# EAGLE design irisc (EAGLE 9.2.2)
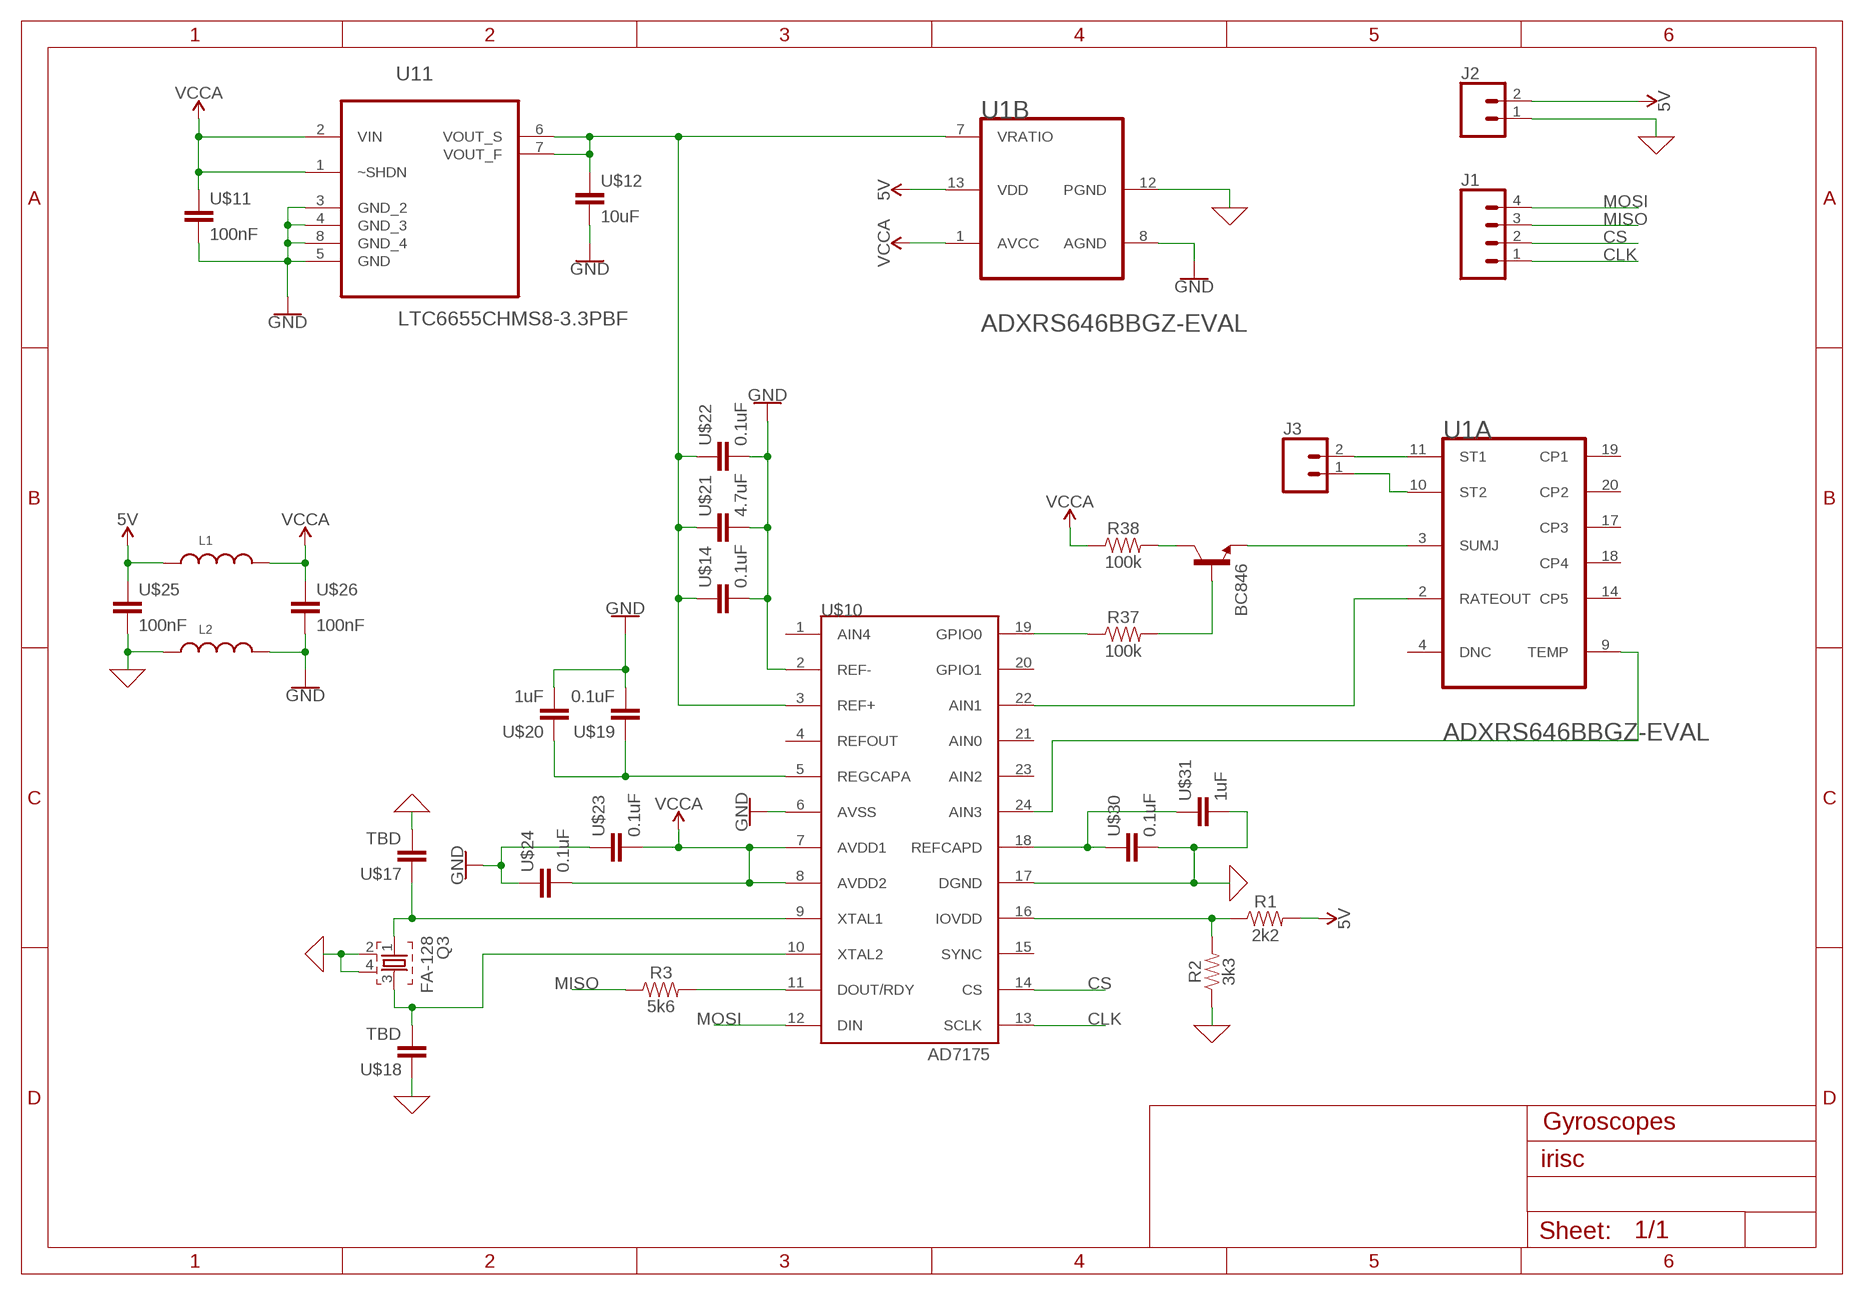
[diagram p0: schematic, sheet 1]

## Parts
J1  CONN_04  [1X04]
J2  CONN_02  [1X02]
J3  CONN_02  [1X02]
L1  WE-CBA_0805_782853152_HC  [WE-CBA_0805(W=4)]
L2  WE-CBA_0805_782853152_HC  [WE-CBA_0805(W=4)]
Q3  FA-128  [FA-128]
R1  2k2  100KOHM-HORIZ_KIT-1/4W-1%  [AXIAL-0.3-KIT]
R2  3k3  100KOHM-HORIZ_KIT-1/4W-1%  [AXIAL-0.3-KIT]
R3  5k6  100KOHM-HORIZ_KIT-1/4W-1%  [AXIAL-0.3-KIT]
R37  100k  100KOHM-HORIZ_KIT-1/4W-1%  [AXIAL-0.3-KIT]
R38  100k  100KOHM-HORIZ_KIT-1/4W-1%  [AXIAL-0.3-KIT]
T1  BC846  [SOT23]
U1  ANALOG_DEVICES_ADXRS646BBGZEVAL  [HDRVR20W64P762X254_2X10_2540X1016X254B]
U11  LTC6655CHMS8-3.3PBF  [SOP65P490X110-8N]
U$10  AD7175  [TSSOP24]
U$11  100nF  CAPACITOR_0603_N  [RESC0603_N]
U$12  10uF  CAPACITOR_0805_L  [RESC0805_L]
U$14  0.1uF  CAPACITOR_0603_N  [RESC0603_N]
U$17  TBD  CAPACITOR_0805_L  [RESC0805_L]
U$18  TBD  CAPACITOR_0805_L  [RESC0805_L]
U$19  0.1uF  CAPACITOR_0603_N  [RESC0603_N]
U$20  1uF  CAPACITOR_0603_N  [RESC0603_N]
U$21  4.7uF  CAPACITOR_0603_N  [RESC0603_N]
U$22  0.1uF  CAPACITOR_0603_N  [RESC0603_N]
U$23  0.1uF  CAPACITOR_0603_N  [RESC0603_N]
U$24  0.1uF  CAPACITOR_0603_N  [RESC0603_N]
U$25  100nF  CAPACITOR_0603_N  [RESC0603_N]
U$26  100nF  CAPACITOR_0603_N  [RESC0603_N]
U$30  0.1uF  CAPACITOR_0603_N  [RESC0603_N]
U$31  1uF  CAPACITOR_0603_N  [RESC0603_N]

## Nets
0: J2.1 L2.1 Q3.2 Q3.4 R2.P$1 U1.12(B:PGND) U$10.17(DGND) U$17.2 U$18.1 U$25.2 U$30.2 U$31.2 ; supply symbol labelled GND
5V: J2.2 L1.1 R1.P$2 U1.13(B:VDD) U$25.1
CLK: J1.1 U$10.13(SCLK)
CS: J1.2 U$10.14(CS)
GND: L2.2 U1.8(B:AGND) U11.3(GND_2) U11.4(GND_3) U11.5(GND) U11.8(GND_4) U$10.2(REF-) U$10.6(AVSS) U$11.2 U$12.2 U$14.2 U$19.2 U$20.2 U$21.2 U$22.2 U$23.1 U$24.1 U$26.2
MISO: J1.3 R3.P$1
MOSI: J1.4 U$10.12(DIN)
N$1: J3.1 U1.10(A:ST2)
N$2: Q3.3 U$10.10(XTAL2) U$18.2
N$40: Q3.1 U$10.9(XTAL1) U$17.1
N$42: J3.2 U1.11(A:ST1)
N$43: R38.P$2 T1.3(C)
N$45: U$10.5(REGCAPA) U$19.1 U$20.1
N$46: R37.P$2 T1.1(B)
N$48: U1.7(B:VRATIO) U11.6(VOUT_S) U11.7(VOUT_F) U$10.3(REF+) U$12.1 U$14.1 U$21.1 U$22.1
N$50: R1.P$1 R2.P$2 U$10.16(IOVDD)
N$51: U$10.18(REFCAPD) U$30.1 U$31.1
N$53: T1.2(E) U1.3(A:SUMJ)
N$58: U1.2(A:RATEOUT) U$10.22(AIN1)
N$59: U1.9(A:TEMP) U$10.24(AIN3)
N$66: R37.P$1 U$10.19(GPIO0)
SDF: R3.P$2 U$10.11(DOUT/RDY)
VCCA: L1.2 R38.P$1 U1.1(B:AVCC) U11.1(~SHDN) U11.2(VIN) U$10.7(AVDD1) U$10.8(AVDD2) U$11.1 U$23.2 U$24.2 U$26.1
Unconnected: U1.4(A:DNC) U1.17(A:CP3) U1.18(A:CP4) U1.19(A:CP1) U1.20(A:CP2) U$10.1(AIN4) U$10.4(REFOUT) U$10.15(SYNC) U$10.20(GPIO1) U$10.21(AIN0) U$10.23(AIN2)

## Notes on the sheet
- Gyroscopes

## Power pins joined to a net without a drawn wire
CP5: U1.14(A:CP5)

## Library data of the parts
J1 = SparkFun-Connectors:CONN_04: Multi connection point. Often used as Generic Header-pin footprint for 0.1 inch spaced/style header connections On any of the 0.1 inch spaced packages, you can populate with these: Break Away Headers - Straight <https://www.sparkfun.com/products/116> (PRT-00116) Break Away Male Headers - Right Angle <https://www.sparkfun.com/products/553> (PRT-00553) Female Headers <https://www.sparkfun.com/products/115> (PRT-00115) Break Away Headers - Machine Pin <https://www.sparkfun.com/products/117> (PRT-00117) Break Away Female Headers - Swiss Machine Pin <https://www.sparkfun.com/products/743> (PRT-00743) For SCREWTERMINALS and SPRING TERMINALS visit here: Screw Terimnals on SparkFun.com <https://www.sparkfun.com/search/results?term=Screw+Terminals> (5mm/3.5mm/2.54mm spacing) This device is also useful as a general connection point to wire up your design to another part of your project. Our various solder wires solder well into these plated through hole pads. Hook-Up Wire - Assortment (Stranded, 22 AWG) <https://www.sparkfun.com/products/11375> (PRT-11375) Hook-Up Wire - Assortment (Solid Core, 22 AWG) <https://www.sparkfun.com/products/11367> (PRT-11367) View the entire wire category on our website here <https://www.sparkfun.com/categories/141> Special notes: Molex polarized connector foot print use with SKU : PRT-08231 with associated crimp pins and housings. 1MM SMD Version SKU: PRT-10208; PROD_ID: CONN-09696
J2 J3 = SparkFun-Connectors:CONN_02: Multi connection point. Often used as Generic Header-pin footprint for 0.1 inch spaced/style header connections On any of the 0.1 inch spaced packages, you can populate with these: Break Away Headers - Straight <https://www.sparkfun.com/products/116> (PRT-00116) Break Away Male Headers - Right Angle <https://www.sparkfun.com/products/553> (PRT-00553) Female Headers <https://www.sparkfun.com/products/115> (PRT-00115) Break Away Headers - Machine Pin <https://www.sparkfun.com/products/117> (PRT-00117) Break Away Female Headers - Swiss Machine Pin <https://www.sparkfun.com/products/743> (PRT-00743) For SCREWTERMINALS and SPRING TERMINALS visit here: Screw Terimnals on SparkFun.com <https://www.sparkfun.com/search/results?term=Screw+Terminals> (5mm/3.5mm/2.54mm spacing) This device is also useful as a general connection point to wire up your design to another part of your project. Our various solder wires solder well into these plated through hole pads. Hook-Up Wire - Assortment (Stranded, 22 AWG) <https://www.sparkfun.com/products/11375> (PRT-11375) Hook-Up Wire - Assortment (Solid Core, 22 AWG) <https://www.sparkfun.com/products/11367> (PRT-11367) View the entire wire category on our website here <https://www.sparkfun.com/categories/141> Special notes: Molex polarized connector foot print use with: PRT-08233 with associated crimp pins and housings. 2.54_SCREWTERM for use with PRT-10571. 3.5mm Screw Terminal footprints for PRT-08084 5mm Screw Terminal footprints for use with PRT-08432
L1 L2 = Wurth_Elektronik_Passive_rev18f:WE-CBA_0805: WE-CBA SMD EMI Suppression Ferrite Bead Characteristics Reliable Ni-Sn electrodes High rated current up to 5A Recommended soldering: Reflow Operating temperature: -55°C to +125°C Applications * Perfect as data line filter and for uncoupling of distribution voltage *This special SMD chip bead ferrites can be put directly on the printed circuit board. They offer excellent anti-EMI properties and low DC-resistance. Placed very close next to the interference source even with smallest size 0402,maximal impedance at 1000 Ω can be reached. *High Speed: "High Speed " SMD ferrites WE-CBF have lower impedance in the lower frequency ranges thus they have only a low attenuation for fast signals. Application e.g. USB 2.0, IEEE 1394,LVDS *Wide Band: "Wide Band" SMD ferrites WE-CBF already show high impedance in low frequency range. Therefore they are wide band through the whole spectrum. Application e.g. control signats, RS232, RS422, DC/DC converter *High Current: "High Current " SMD ferrites WE-CBF are designed for high current (over 1 A). The rated current refers to 40K self-heating. High current SMD ferrites are available in all there types (High Speed, Wide Band and High Frequency). Application e.g. power supply, DC/DC converter *Advice: Pay attention for the use of SMD-Ferrites for high current>1A and ambient temperature over +85°C that the rated current has to be reduced when temperature is above +85°C (Derating). *At+100°C environment temperature the maximal rated current has to add up to only 60% of the data sheet value ,without an overload of the component. Variant abbreviation WB means WIDE BAND HS means HIGH SPEED HC means HIGH CURRENT <http://katalog.we-online.de/media/images/v2/Family_WE-CBA.jpg> Details see: http://katalog.we-online.de/en/pbs/WE-CBA/ Created: 2015-02-02 2015 (C) Wurth Elektronik
Q3 = crystal:FA-: MHz RANGE CRYSTAL UNIT Source: Epson Toyocom
R1-R3 = SparkFun-Resistors:100KOHM: 100kΩ resistor A resistor is a passive two-terminal electrical component that implements electrical resistance as a circuit element. Resistors act to reduce current flow, and, at the same time, act to lower voltage levels within circuits. - Wikipedia; PROD_ID: RES-12184; VALUE: 100k
R37 R38 = SparkFun-Resistors:100KOHM: 100kΩ resistor A resistor is a passive two-terminal electrical component that implements electrical resistance as a circuit element. Resistors act to reduce current flow, and, at the same time, act to lower voltage levels within circuits. - Wikipedia; PROD_ID: RES-12184
T1 = transistor:BC846: NPN TRANSISTOR
U1 = Analog Devices - ADXRS646BBGZ-EVAL:ANALOG_DEVICES_ADXRS646BBGZ: ADI-ADXRS646-BG-32-3
U11 = LTC6655CHMS8-3.3PBF:LTC6655CHMS8-3.3PBF: 0.25ppm Noise, Low Drift Precision Buffered Reference; AVAILABILITY: Unavailable; DESCRIPTION: LTC6655 - 0.25ppm Noise, Low Drift Precision References; MF: Linear Technology/Analog; MP: LTC6655CHMS8-3.3#PBF; PACKAGE: MSOP-8 Linear Technology; PRICE: None
U$10 = Analog Devices - AD7997BRUZ-1REEL:AD7175
U$11 U$12 U$14 U$17-U$26 U$30 U$31 = Nordic_nRF:CAPACITOR: Generic chip capacitor

## Board
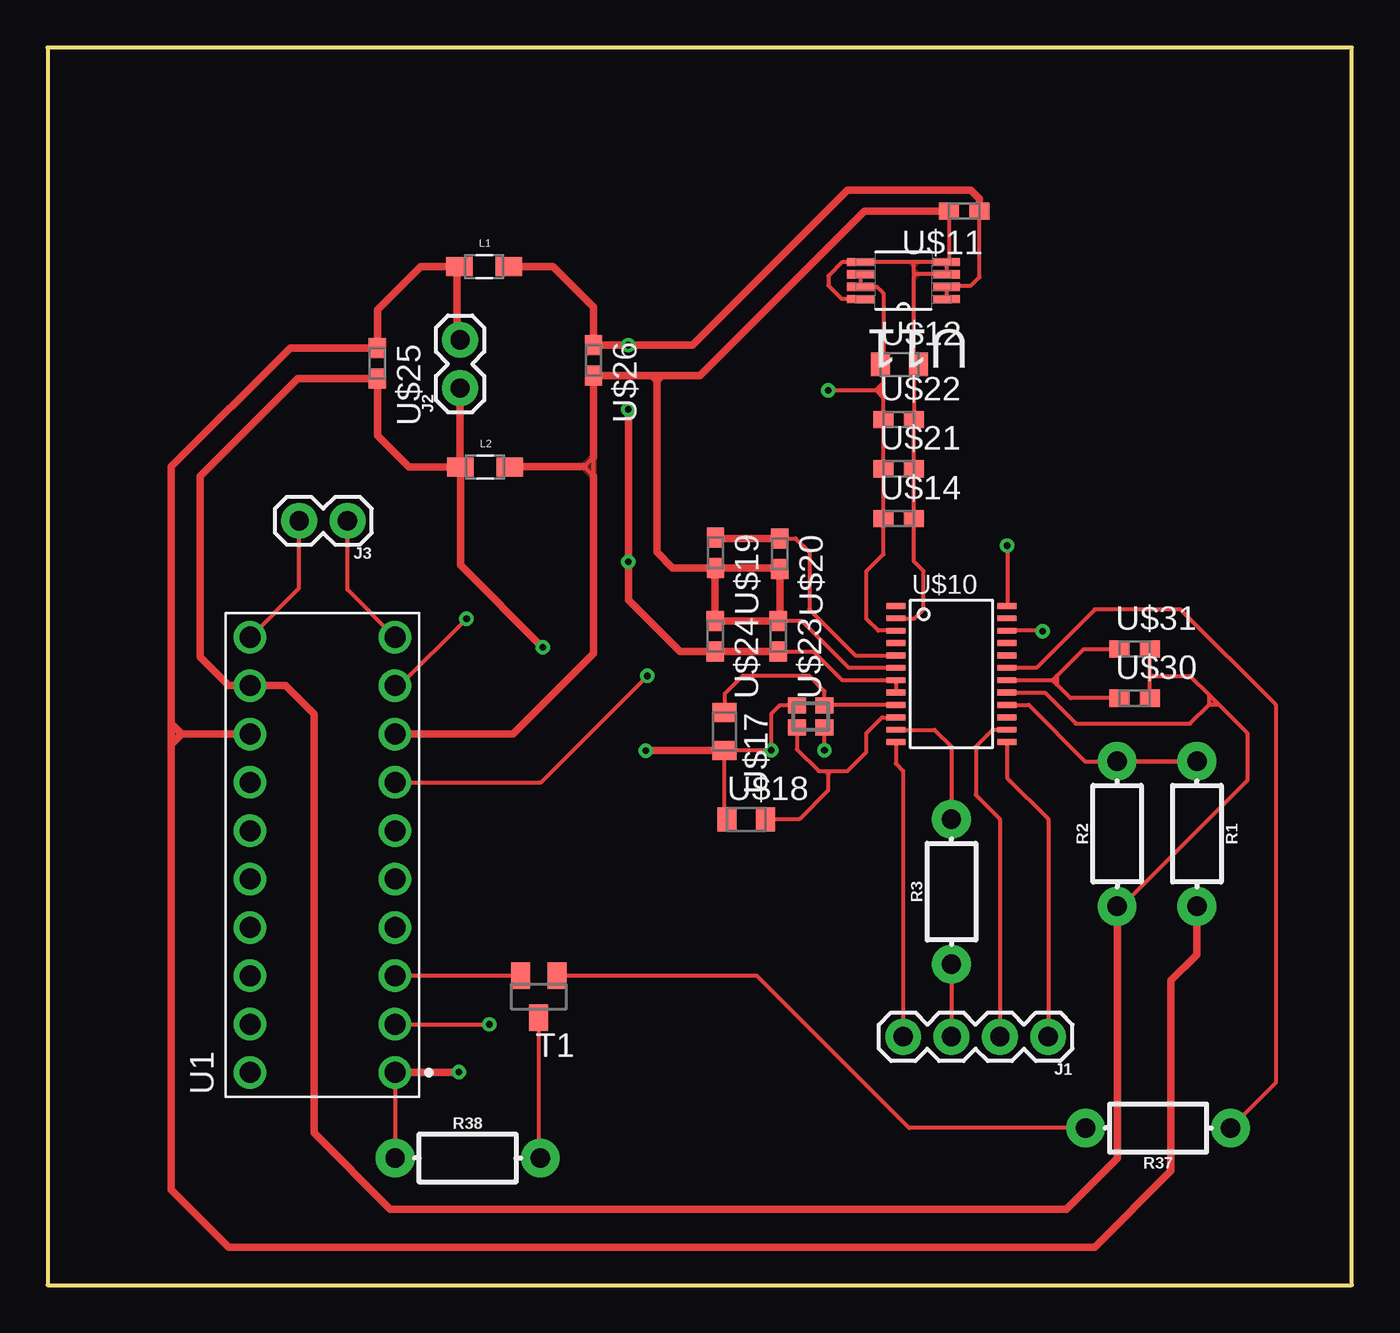
[diagram p1: board, top side]
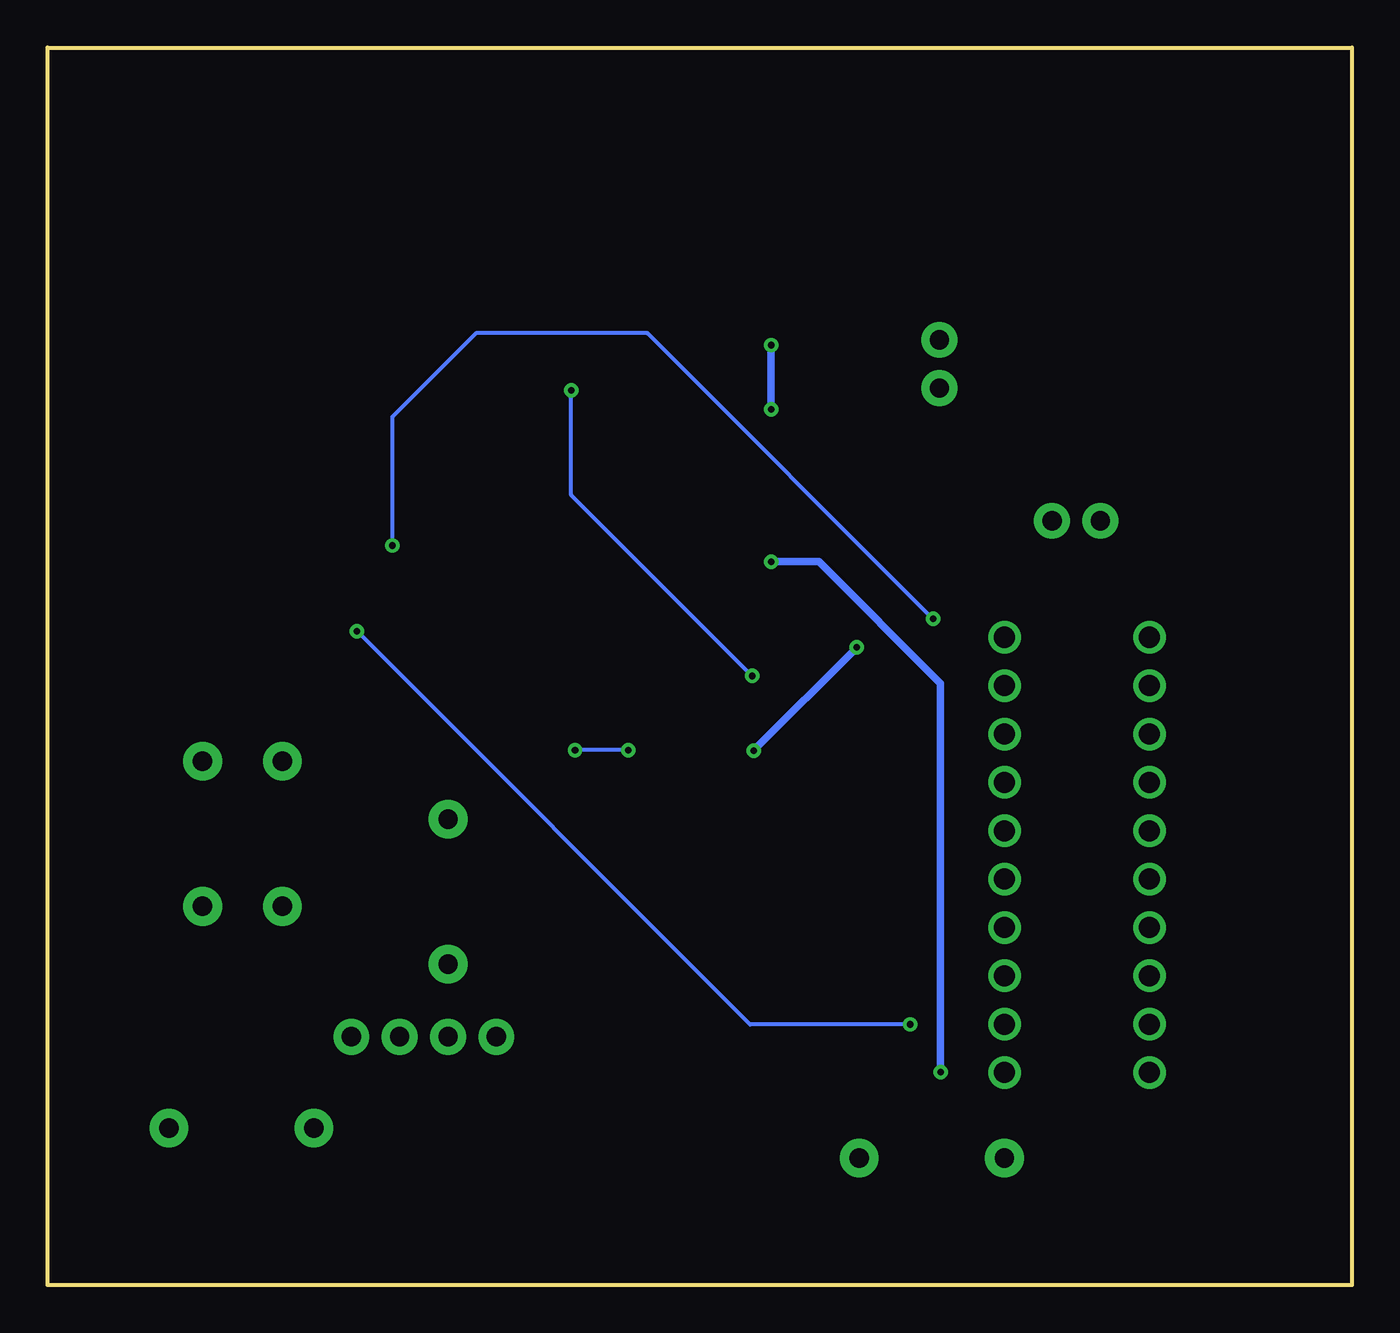
[diagram p2: board, bottom side, seen from below]

Size 68.5 x 65 mm. Coordinates in mm from the lower left corner, seen from the top.
Outline: 0,0 68.5,0 68.5,65 0,65 0,0
Copper layers (1*16): Top 0.035mm / dielectric 1.5mm / Bottom 0.035mm
Design rules "default": minimum track width 6mil, minimum drill 0.35mm, track to track 6mil, track to pad 6mil, pad to pad 6mil, via to via 6mil, smd to smd 6mil, copper to edge 40mil, drill to drill 6mil, minimum pad ring 10mil, minimum via ring 8mil, stop-mask expansion 4mil, vias tented up to drill 0mil, thermal gap 10mil

### Footprints (pad centres in the part's own frame; a part is rotated, then mirrored left to right if it is on the bottom)
1X04 = drill 1.016 pad 1.88: 1 0,0; 2 2.54,0; 3 5.08,0; 4 7.62,0
1X02 = drill 1.016 pad 1.88: 1 0,0; 2 2.54,0
WE-CBA_0805(W=4) = smd 1.4 x 1: 1 -1.3,0; 2 1.3,0
FA-128 = smd 0.95 x 0.85: 1 -0.725,-0.575; 2 0.725,-0.575; 3 0.725,0.575; 4 -0.725,0.575
AXIAL-0.3-KIT = drill 1.016 pad 2.032: P$1 -3.81,0; P$2 3.81,0
SOT23 = smd 1 x 1.4: 1 -0.95,-1.1; 2 0.95,-1.1; 3 0,1.1
HDRVR20W64P762X254_2X10_2540X1016X254B = drill 1.105 pad 1.705: 1 0,0; 2 2.54,0; 3 5.08,0; 4 7.62,0; 5 10.16,0; 6 12.7,0; 7 15.24,0; 8 17.78,0; 9 20.32,0; 10 22.86,0; 11 22.86,7.62; 12 20.32,7.62; 13 17.78,7.62; 14 15.24,7.62; 15 12.7,7.62; 16 10.16,7.62; 17 7.62,7.62; 18 5.08,7.62; 19 2.54,7.62; 20 0,7.62
SOP65P490X110-8N = smd 1.397 x 0.432: 1 -2.261,0.965; 2 -2.261,0.33; 3 -2.261,-0.33; 4 -2.261,-0.965; 5 2.261,-0.965; 6 2.261,-0.33; 7 2.261,0.33; 8 2.261,0.965
TSSOP24 = smd 0.305 x 0.991: 1 -3.575,-2.918; 2 -2.925,-2.918; 3 -2.275,-2.918; 4 -1.625,-2.918; 5 -0.975,-2.918; 6 -0.325,-2.918; 7 0.325,-2.918; 8 0.975,-2.918; 9 1.625,-2.918; 10 2.275,-2.918; 11 2.925,-2.918; 12 3.575,-2.918; 13 3.575,2.918; 14 2.925,2.918; 15 2.275,2.918; 16 1.625,2.918; 17 0.975,2.918; 18 0.325,2.918; 19 -0.325,2.918; 20 -0.975,2.918; 21 -1.625,2.918; 22 -2.275,2.918; 23 -2.925,2.918; 24 -3.575,2.918
RESC0603_N = smd 1.05 x 0.9: 1 -0.8,0; 2 0.8,0
RESC0805_L = smd 1 x 1.25: 1 -1,0; 2 1,0

### Placement (x,y rotation side)
J1  52.55,13.05 180 top
J2  21.66,47.12 90 top
J3  15.75,40.15 180 top
L1  22.93,53.49 0 top
L2  22.98,42.97 0 top
Q3  40.08,29.87 180 top
R1  60.36,23.71 270 top
R2  56.17,23.71 90 top
R3  47.47,20.67 90 top
R37  58.33,8.26 180 top
R38  22.06,6.68 0 top
T1  25.8,15.15 180 top
U1  18.25,11.17 90 top
U11  44.95,52.76 180 top
U$10  47.47,32.1 270 top
U$11  48.14,56.41 180 top
U$12  44.74,48.36 0 top
U$14  44.7,40.26 0 top
U$17  35.55,29.08 270 top
U$18  36.69,24.47 0 top
U$19  35.07,38.47 270 top
U$20  38.45,38.42 270 top
U$21  44.7,42.88 0 top
U$22  44.7,45.46 0 top
U$23  38.37,34.08 270 top
U$24  35.06,34.08 270 top
U$25  17.32,48.42 270 top
U$26  28.67,48.58 270 top
U$30  57.09,30.83 0 top
U$31  57.09,33.41 0 top

### Tracks (layer width: path | path; a pad name or v marks a point on that pad's centre or on a via)
0  (via drill 0.35)
  Top 0.2: U$30.2 57.89,32 | 57.89,32 U$31.2 | 57.89,32 60,32 61,31 | 61,31 61.5,30.5 | 61.5,30.5 63,29 63,26.5 56.4,19.9 R2.P$1 | U$10.17 52.38,31.12 54,29.5 60,29.5 61,30.5 | 61,30.5 61.5,30.5 | 61,30.5 61,31 | U$18.1 35.55,24.61 U$17.2 37.98,28.08 v38,28.1 38,30 38.45,30.45 Q3.2 | 21.66,42.99 L2.1 | v40.8,28.1 v40.8,28.11 Q3.4 | 12.5,31.5 12.49,31.49
  Top 0.4: J2.1 21.66,42.99 | U$17.2 v31.42,28.08 | v26,33.5 21.68,37.82 L2.1 18.98,42.97 17.32,44.62 U$25.2 13.12,47.62 8,42.5 8,33 9.51,31.49 U1.12 12.49,31.49 | R2.P$1 56.17,6.67 53.5,4 18,4 14,8 14,30 12.5,31.5
  Bottom 0.2: v38,28.1 v40.8,28.1
  Bottom 0.4: v26,33.5 v31.42,28.08
  pour Top: 57.9,32.15 58.05,32 57.9,31.85
  pour Top: 61,30.5 61,31 61.5,30.5
5V
  Top 0.2: L1.1 21.5,53.49 | J2.2 21.5,49.81
  Top 0.4: 21.5,49.81 21.5,53.49 19.59,53.49 17.32,51.23 U$25.1 12.72,49.23 6.5,43 6.5,29.5 | R1.P$2 60.36,17.36 59,16 59,6 55,2 9.5,2 6.5,5 6.5,28.35 6.5,28.4 | 6.5,28.4 6.5,29.5 | 7.05,28.95 6.5,29.5 | U1.13 7.05,28.95 | 7.05,28.95 6.5,28.4
  pour Top: 6.5,29.5 7,29 6.5,28.5
CLK
  Top 0.2: U$10.13 50.39,26.64 52.55,24.48 J1.1
CS
  Top 0.2: U$10.14 49.62,29.18 48.74,28.29 48.74,25.75 50.01,24.48 J1.2
GND
  Top 0.2: U$10.6 42.08,32.42 39.62,34.88 U$23.1 38.45,34.96 | U$19.2 | 38.4,37.67 U$20.2 | U$10.2 45.52,35.02 46,35.5 46,37.5 45.5,38 U$14.2 U$21.2 U$22.2 45.5,48.12 U$12.2 45.74,48.63 45.5,48.88 45.5,53.02 45.58,53.09 | U11.4 47.21,53.5 | 47.21,53.5 U11.3 45.58,53.09 | U11.4 45.5,53.73 | 45.5,53.73 U11.5 41.73,53.73 41,53 41,52.5 41.7,51.8 U11.8 | 45.5,53.73 45.5,53.1 45.51,53.09 45.58,53.09 | 47.37,53.66 47.21,53.5 | U$11.2 47.34,53.85 U11.4 | L2.2 24.31,43 | 32,47.5 32,47.77 | 32.27,47.77 32.3,47.77 | 28.67,42.5 28.67,43.5 28.17,43 28.67,42.5
  Top 0.4: U$23.1 U$24.1 U$19.2 | 38.4,37.67 U$19.2 32.83,37.67 32,38.5 32,47.5 | U$20.2 38.45,34.96 | 28.67,43.5 U$26.2 31.73,47.77 | 31.73,47.77 32,47.77 32.27,47.77 32,47.5 | 32.3,47.77 34.27,47.77 42.91,56.41 U$11.2 | U1.8 24.45,28.95 25.5,30 28.67,33.17 28.67,42.5 | 24.31,43 28.17,43 | 31.73,47.77 32,47.5
  pour Top: 45.75,53.1 45.5,53.35 45.5,52.85
  pour Top: 45.73,53.73 45.5,53.5 45.27,53.73
  pour Top: 28.15,43 28.65,43.5 28.65,42.55 28.65,42.5
MISO
  Top 0.2: R3.P$1 J1.3
MOSI
  Top 0.2: U$10.12 44.55,27.4 44.93,27.02 J1.4
N$1
  Top 0.2: U1.10 15.75,36.53 J3.1
N$2
  Top 0.2: Q3.3 39.35,28.14 40.5,27 41,27 | 41,27 42,27 43,28 43,29 43.83,29.82 U$10.10 | U$18.2 37.72,24.5 39.5,24.5 41,26 41,27
  pour Top: 41.2,27 41,26.8 40.8,27
N$40
  Top 0.2: U$10.9 40.84,30.48 Q3.1 40.8,31.2 40,32 36.5,32 35.55,31.05 U$17.1
N$42
  Top 0.2: U1.11 13.21,36.61 J3.2
N$43
  Top 0.2: T1.3 25.8,6.75 R38.P$2
N$45
  Top 0.2: 35.12,39.22 U$19.1 | U$20.1 39.28,39.22 40,38.5 40,35.5 42.42,33.08 U$10.5
  Top 0.4: U$20.1 35.12,39.22
N$46
  Top 0.2: R37.P$2 45.24,8.26 37.24,16.25 T1.1
N$48  (via drill 0.35)
  Top 0.2: U$10.3 43.62,34.38 43,35 43,37.5 43.9,38.4 U$14.1 U$21.1 U$22.1 43.9,46.6 | U11.6 U11.7 43.57,52.43 43.9,52.1 43.9,48.52 U$12.1 43.9,48.2 43.9,47.4 | 43.9,46.6 43.9,47 | U1.7 25.91,26.41 v31.5,32 | v41,47 43.5,47 | 43.5,47 43.9,47 | 43.9,47 43.9,47.4 | 43.5,47 43.9,47.4 | 43.5,47 43.9,46.6
  Bottom 0.2: v31.5,32 41,41.5 v41,47
  pour Top: 43.5,47 43.9,47.4 43.9,46.6
N$50
  Top 0.2: U$10.16 51.52,30.48 54.48,27.52 R1.P$1 R2.P$2
N$51
  Top 0.2: U$10.18 52.77,31.77 | U$31.1 54.41,33.41 53,32 | 52.77,31.77 52.93,31.93 | U$30.1 53.72,30.83 53,31.55 | 53,31.55 52.83,31.72 | 53,32 53,31.72 | 53,31.72 53,31.55 | 52.77,31.77 52.83,31.72 | 52.83,31.72 52.93,31.72 | 52.93,31.72 53,31.72 | 53,32 52.93,31.93 | 52.93,31.93 52.93,31.72
N$53
  Top 0.2: T1.2 U1.3
N$58  (via drill 0.35)
  Top 0.2: U1.2 v23.19,13.71 v23.2,13.7 | v52.25,34.35 52.23,34.38 U$10.22
  Bottom 0.2: v23.2,13.7 31.6,13.7 v52.25,34.35
N$59  (via drill 0.35)
  Top 0.2: 18.49,31.49 v22,35 | v50.4,38.85 U$10.24
  Top 0.4: U1.9 18.49,31.49
  Bottom 0.2: v22,35 37,50 46,50 50.4,45.6 v50.4,38.85
N$66
  Top 0.2: R37.P$1 64.5,10.62 64.5,30.5 59.5,35.5 55,35.5 51.92,32.42 U$10.19
SDF
  Top 0.2: U$10.11 46.59,29.18 47.47,28.29 R3.P$2
VCCA  (via drill 0.35)
  Top 0.2: U$10.8 U$10.7 41.73,31.77 40.22,33.28 U$23.2 | U11.1 U11.2 47.28,52.5 48.5,52.5 48.94,52.94 U$11.1 | U1.1 R38.P$1 | 21.57,11.17 v21.6,11.2
  Top 0.4: U$23.2 U$24.2 33.22,33.28 30.5,36 v30.5,38 v30.5,46 | L1.2 26.55,53.49 28.67,51.38 U$26.1 v30.5,49.38 33,49.38 33.88,49.38 42,57.5 48.5,57.5 48.94,57.06 U$11.1 | U1.1 21.57,11.17
  Bottom 0.4: v30.5,46 v30.5,49.38 | v21.6,11.2 21.6,31.6 28,38 v30.5,38